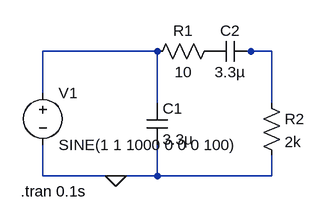
[diagram p0: schematic Draft1.asc]
Draft1.asc, the LTspice schematic file:
Version 4
SHEET 1 880 680
WIRE 144 96 -32 96
WIRE 288 96 272 96
WIRE 320 96 288 96
WIRE -32 160 -32 96
WIRE 144 176 144 96
WIRE 320 176 320 96
WIRE -32 288 -32 240
WIRE 80 288 -32 288
WIRE 144 288 144 240
WIRE 144 288 80 288
WIRE 320 288 320 256
WIRE 320 288 144 288
FLAG 80 288 0
SYMBOL res 240 80 R90
WINDOW 0 0 56 VBottom 2
WINDOW 3 32 56 VTop 2
SYMATTR InstName R1
SYMATTR Value 10
SYMBOL res 304 160 R0
SYMATTR InstName R2
SYMATTR Value 2k
SYMBOL cap 128 176 R0
SYMATTR InstName C1
SYMATTR Value 3.3µ
SYMBOL voltage -32 144 R0
WINDOW 123 0 0 Left 0
WINDOW 39 0 0 Left 0
SYMATTR InstName V1
SYMATTR Value SINE(1 1 1000 0 0 0 100)
SYMBOL cap 288 80 R90
WINDOW 0 0 32 VBottom 2
WINDOW 3 32 32 VTop 2
SYMATTR InstName C2
SYMATTR Value 3.3µ
TEXT -66 312 Left 2 !.tran 0.1s

The netlist it stands for:
* Draft1.asc
R1 P001 N001 10
R2 N002 0 2k
C1 N001 0 3.3µ
V1 N001 0 SINE(1 1 1000 0 0 0 100)
C2 N002 P001 3.3µ
.tran 0.1s
.backanno
.end